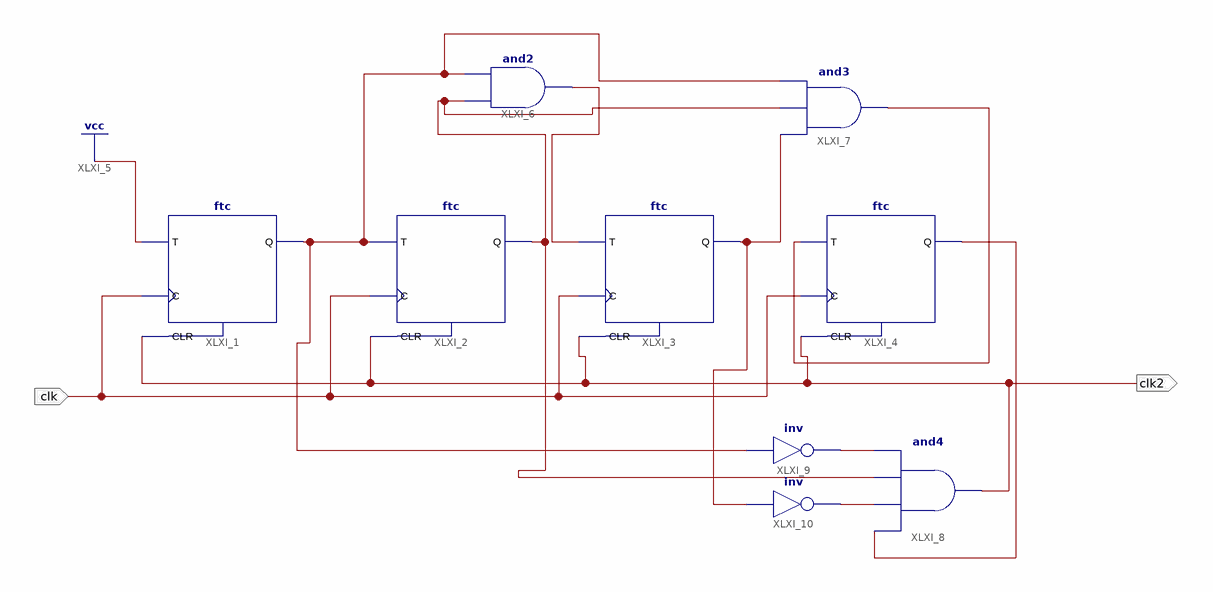
[diagram p0: schematic sheet 1]
// Xilinx ISE schematic counter0_9.sch (spartan6) as structural Verilog: 9 symbols, 2 ports
module counter0_9 (
  input  clk,
  output clk2
);

  wire XLXN_7, XLXN_11, XLXN_12, XLXN_13, XLXN_19, XLXN_20, XLXN_21, XLXN_23;

  ftc XLXI_1 (.C(clk), .CLR(clk2), .T(1'b1), .Q(XLXN_21));
  ftc XLXI_2 (.C(clk), .CLR(clk2), .T(XLXN_21), .Q(XLXN_13));
  ftc XLXI_3 (.C(clk), .CLR(clk2), .T(XLXN_7), .Q(XLXN_11));
  ftc XLXI_4 (.C(clk), .CLR(clk2), .T(XLXN_12), .Q(XLXN_23));
  and XLXI_6 (XLXN_7, XLXN_13, XLXN_21);
  and XLXI_7 (XLXN_12, XLXN_11, XLXN_13, XLXN_21);
  and XLXI_8 (clk2, XLXN_23, XLXN_20, XLXN_13, XLXN_19);
  not XLXI_9 (XLXN_19, XLXN_21);
  not XLXI_10 (XLXN_20, XLXN_11);
endmodule
